# Altium schematic sheet 4_接口.schdoc.schdoc
size 309 x 223 mm; Symbol: Sheet-Symbol_A4; Device: Sheet-Symbol_A4; Company: 嘉立创EDA; Drawed: 吴登珂; Version: V1.0; Page Size: A4; @Project Name: 最小系统板; @Page Count: 4; @Update Date: 2024-04-09; @Create Date: 2024-04-05; @Schematic Name: Schematic1; @Page No: 2; @Page Name: 接口
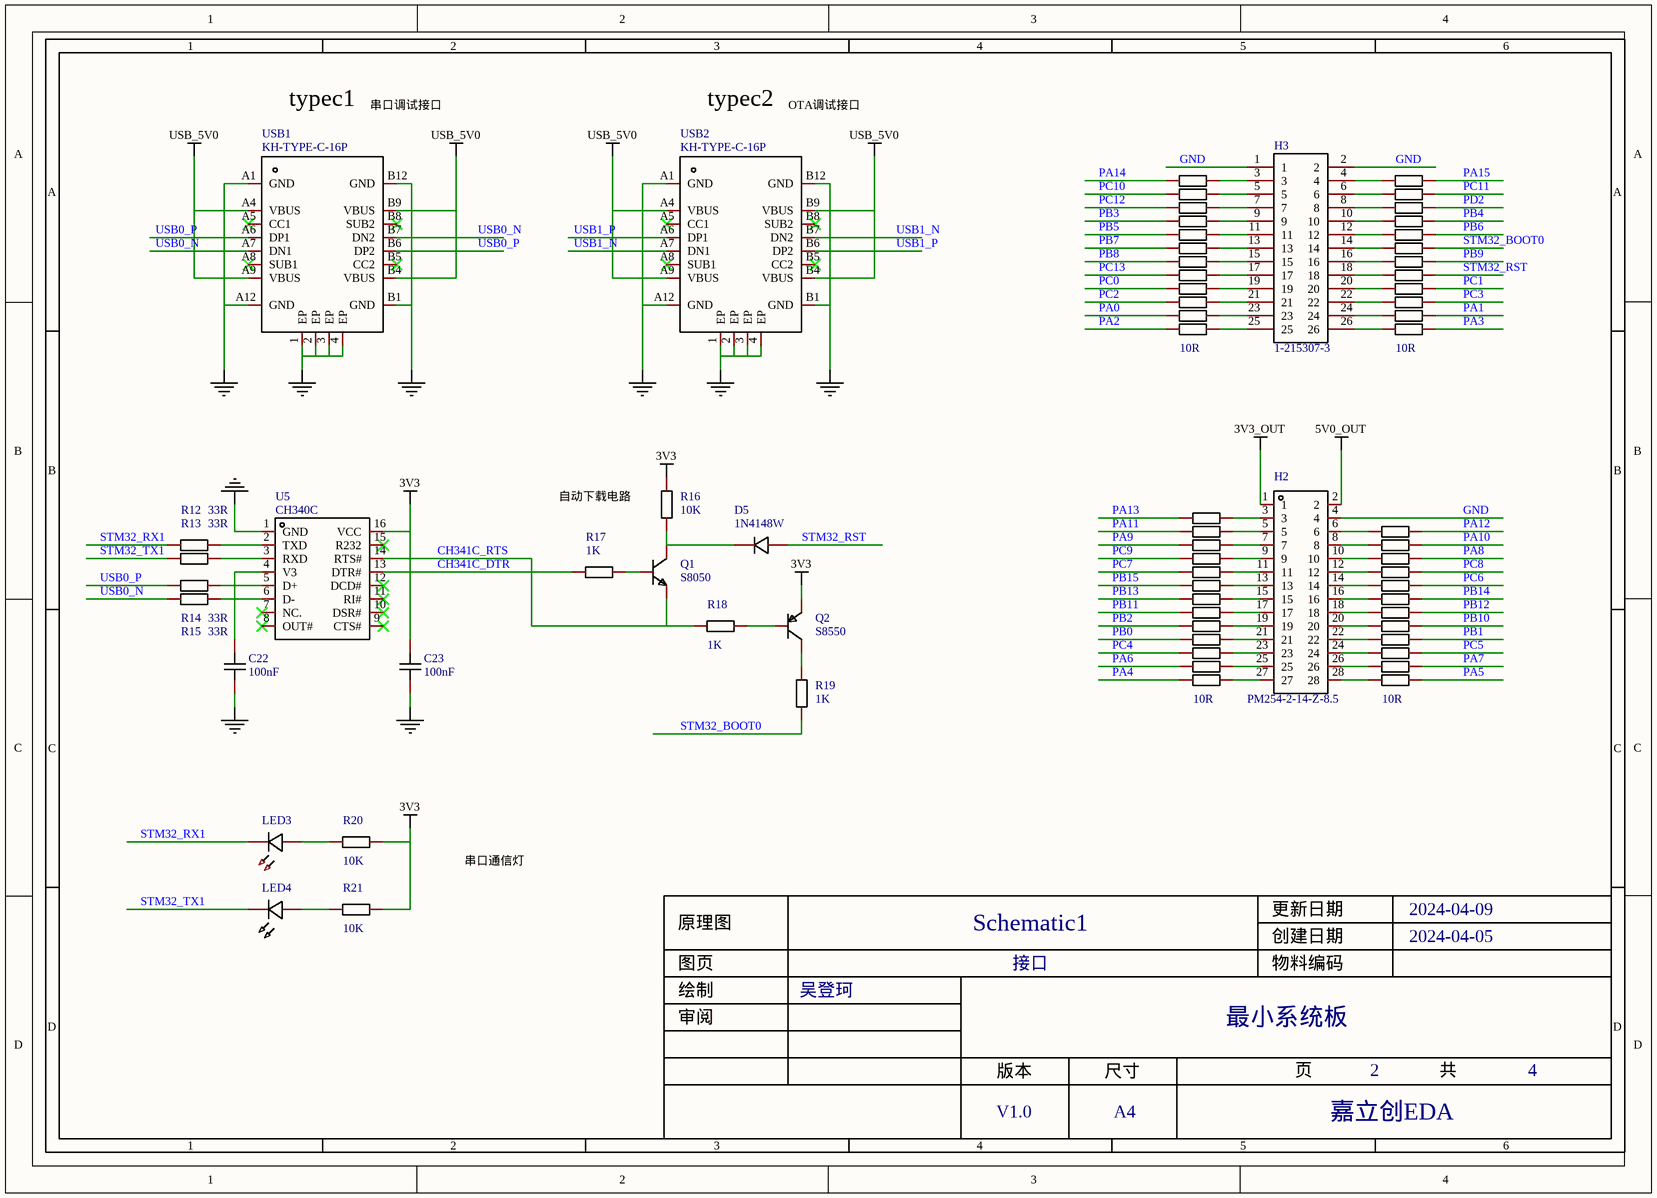
[diagram p0: 4_接口.schdoc.schdoc]

## Parts
C22  100nF  [C0603]
C23  100nF  [C0603]
D5  1N4148W  [SOD-123F_L2.7-W1.6-LS3.8-RD]
H2  PM254-2-14-Z-8.5  [HDR-TH_28P-P2.54-V-F-R2-C14-S2.54-1]
H3  1-215307-3  [HDR-TH_26P-P2.54-V-F-R2-C13-S2.54-1]
LED3  LED_0603-G  [LED_0603]  (value not drawn)
LED4  LED_0603-B  [LED_0603]  (value not drawn)
Q1  S8050  [SOT-23-3_L2.9-W1.3-P1.90-LS2.4-BR]
Q2  S8550  [SOT-23-3_L2.9-W1.6-P1.90-LS2.8-BR]
R12  33R  [R0603]
R13  33R  [R0603]
R14  33R  [R0603]
R15  33R  [R0603]
R16  10K  [R0603]
R17  1K  [R0603]
R18  1K  [R0603]
R19  1K  [R0603]
R20  10K  [R0603]
R21  10K  [R0603]
R27  10R  [R0603]  (value not drawn)
R28  10R  [R0603]  (value not drawn)
R29  10R  [R0603]  (value not drawn)
R30  10R  [R0603]  (value not drawn)
R31  10R  [R0603]  (value not drawn)
R32  10R  [R0603]  (value not drawn)
R33  10R  [R0603]  (value not drawn)
R34  10R  [R0603]  (value not drawn)
R35  10R  [R0603]  (value not drawn)
R36  10R  [R0603]  (value not drawn)
R37  10R  [R0603]  (value not drawn)
R38  10R  [R0603]
R39  10R  [R0603]  (value not drawn)
R40  10R  [R0603]  (value not drawn)
R41  10R  [R0603]  (value not drawn)
R42  10R  [R0603]  (value not drawn)
R43  10R  [R0603]  (value not drawn)
R44  10R  [R0603]  (value not drawn)
R45  10R  [R0603]  (value not drawn)
R46  10R  [R0603]  (value not drawn)
R47  10R  [R0603]  (value not drawn)
R48  10R  [R0603]  (value not drawn)
R49  10R  [R0603]  (value not drawn)
R50  10R  [R0603]
R51  10R  [R0603]  (value not drawn)
R52  10R  [R0603]  (value not drawn)
R53  10R  [R0603]  (value not drawn)
R54  10R  [R0603]  (value not drawn)
R55  10R  [R0603]  (value not drawn)
R56  10R  [R0603]  (value not drawn)
R57  10R  [R0603]  (value not drawn)
R58  10R  [R0603]  (value not drawn)
R59  10R  [R0603]  (value not drawn)
R60  10R  [R0603]  (value not drawn)
R61  10R  [R0603]  (value not drawn)
R62  10R  [R0603]  (value not drawn)
R63  10R  [R0603]
R64  10R  [R0603]
R65  10R  [R0603]  (value not drawn)
R66  10R  [R0603]  (value not drawn)
R67  10R  [R0603]  (value not drawn)
R68  10R  [R0603]  (value not drawn)
R69  10R  [R0603]  (value not drawn)
R70  10R  [R0603]  (value not drawn)
R71  10R  [R0603]  (value not drawn)
R72  10R  [R0603]  (value not drawn)
R73  10R  [R0603]  (value not drawn)
R74  10R  [R0603]  (value not drawn)
R75  10R  [R0603]  (value not drawn)
U5  CH340C  [SOP-16_L10.0-W3.9-P1.27-LS6.0-BL]
USB1  KH-TYPE-C-16P  [USB-C-SMD_KH-TYPE-C-16P]
USB2  KH-TYPE-C-16P  [USB-C-SMD_KH-TYPE-C-16P]

## Nets
3V3: C23.2 Q2.2 R16.2 R20.1 R21.1 U5.16(VCC)
3V3_OUT: H2.1
5V0_OUT: H2.2
NetC22_1: C22.1 C23.1 U5.1(GND) USB1.1(EP) USB1.2(EP) USB1.3(EP) USB1.4(EP) USB1.A1(GND) USB1.A12(GND) USB1.B1(GND) USB1.B12(GND) USB2.1(EP) USB2.2(EP) USB2.3(EP) USB2.4(EP) USB2.A1(GND) USB2.A12(GND) USB2.B1(GND) USB2.B12(GND)
USB_5V0: USB1.A4(VBUS) USB1.A9(VBUS) USB1.B4(VBUS) USB1.B9(VBUS) USB2.A4(VBUS) USB2.A9(VBUS) USB2.B4(VBUS) USB2.B9(VBUS)
CH341C_DTR: R17.1 U5.13(DTR#)
CH341C_RTS: Q1.2(E) R18.2 U5.14(RTS#)
GND: H2.4 H3.1 H3.2
PA0: R37.1
PA1: R49.2
PA2: R38.1
PA3: R50.2
PA4: R63.1
PA5: R64.2
PA6: R62.1
PA7: R65.2
PA8: R73.2
PA9: R53.1
PA10: R75.2
PA11: R52.1
PA12: R74.2
PA13: R51.1
PA14: R27.1
PA15: R39.2
PB0: R60.1
PB1: R67.2
PB2: R59.1
PB3: R30.1
PB4: R41.2
PB5: R31.1
PB6: R43.2
PB7: R32.1
PB8: R33.1
PB9: R45.2
PB10: R68.2
PB11: R58.1
PB12: R69.2
PB13: R57.1
PB14: R70.2
PB15: R56.1
PC0: R35.1
PC1: R47.2
PC2: R36.1
PC3: R48.2
PC4: R61.1
PC5: R66.2
PC6: R71.2
PC7: R55.1
PC8: R72.2
PC9: R54.1
PC10: R28.1
PC11: R40.2
PC12: R29.1
PC13: R34.1
PD2: R42.2
STM32_BOOT0: R19.1 R44.2
STM32_RST: D5.2(A) R46.2
STM32_RX1: LED3.1(C) R12.1
STM32_TX1: LED4.1(C) R13.1
USB0_N: R15.1 USB1.A7(DN1) USB1.B7(DN2)
USB0_P: R14.1 USB1.A6(DP1) USB1.B6(DP2)
USB1_N: USB2.A7(DN1) USB2.B7(DN2)
USB1_P: USB2.A6(DP1) USB2.B6(DP2)
NetC22_2: C22.2 U5.4(V3)
NetD5_1: D5.1(K) Q1.3(C) R16.1
NetH2_3: H2.3 R51.2
NetH2_5: H2.5 R52.2
NetH2_6: H2.6 R74.1
NetH2_7: H2.7 R53.2
NetH2_8: H2.8 R75.1
NetH2_9: H2.9 R54.2
NetH2_10: H2.10 R73.1
NetH2_11: H2.11 R55.2
NetH2_12: H2.12 R72.1
NetH2_13: H2.13 R56.2
NetH2_14: H2.14 R71.1
NetH2_15: H2.15 R57.2
NetH2_16: H2.16 R70.1
NetH2_17: H2.17 R58.2
NetH2_18: H2.18 R69.1
NetH2_19: H2.19 R59.2
NetH2_20: H2.20 R68.1
NetH2_21: H2.21 R60.2
NetH2_22: H2.22 R67.1
NetH2_23: H2.23 R61.2
NetH2_24: H2.24 R66.1
NetH2_25: H2.25 R62.2
NetH2_26: H2.26 R65.1
NetH2_27: H2.27 R63.2
NetH2_28: H2.28 R64.1
NetH3_3: H3.3 R27.2
NetH3_4: H3.4 R39.1
NetH3_5: H3.5 R28.2
NetH3_6: H3.6 R40.1
NetH3_7: H3.7 R29.2
NetH3_8: H3.8 R42.1
NetH3_9: H3.9 R30.2
NetH3_10: H3.10 R41.1
NetH3_11: H3.11 R31.2
NetH3_12: H3.12 R43.1
NetH3_13: H3.13 R32.2
NetH3_14: H3.14 R44.1
NetH3_15: H3.15 R33.2
NetH3_16: H3.16 R45.1
NetH3_17: H3.17 R34.2
NetH3_18: H3.18 R46.1
NetH3_19: H3.19 R35.2
NetH3_20: H3.20 R47.1
NetH3_21: H3.21 R36.2
NetH3_22: H3.22 R48.1
NetH3_23: H3.23 R37.2
NetH3_24: H3.24 R49.1
NetH3_25: H3.25 R38.2
NetH3_26: H3.26 R50.1
NetLED3_2: LED3.2(A) R20.2
NetLED4_2: LED4.2(A) R21.2
NetQ1_1: Q1.1(B) R17.2
NetQ2_1: Q2.1 R18.1
NetQ2_3: Q2.3 R19.2
NetR12_2: R12.2 U5.2(TXD)
NetR13_2: R13.2 U5.3(RXD)
NetR14_2: R14.2 U5.5(D+)
NetR15_2: R15.2 U5.6(D-)

Not connected (* = marked no-connect by the designer): U5 7(NC.)* 8(OUT#)* 9(CTS#)* 10(DSR#)* 11(RI#)* 12(DCD#)* 15(R232)*; USB1 A5(CC1)* A8(SUB1)* B5(CC2)* B8(SUB2)*; USB2 A5(CC1)* A8(SUB1)* B5(CC2)* B8(SUB2)*

## Notes on the sheet
- typec1
- 串口调试接口
- typec2
- OTA调试接口
- 自动下载电路
- 串口通信灯
- 1
- 2
- 3
- 4
- 5
- 6
- A
- B
- C
- 原理图
- Schematic1
- 创建日期
- 更新日期
- 2024-04-09
- 2024-04-05
- 审阅
- 绘制
- 图页
- 吴登珂
- 接口
- 物料编码
- 最小系统板
- D
- 版本
- 尺寸
- 页
- 共
- V1.0
- A4
- 嘉立创EDA

## Library data of the parts
C22 C23 = CAP_0603: Symbol: CapAcitance; Convert to PCB: yes; Name: 100nF; Device: CAP_0603; Add into BOM: yes; Supplier Footprint: 0603; Value: 100nF
D5 = 1N4148W_C81598: Manufacturer: ST(先科); Add into BOM: yes; Diode Configuration: 独立式; Forward Voltage (Vf@If): 1V@50mA; Reverse Voltage (Vr): 75V; Average Rectified Current (Io): 150mA; Power Dissipation: 400mW; Reverse Leakage Current: 1uA@75V; Reverse Recovery Time (trr): 4ns; Description: 二极管配置:独立式;正向压降(Vf):1V@50mA;直流反向耐压(Vr):75V;平均整流电流(Io):150mA;功率:400mW;反向恢复时间(trr):4ns;; Name: 1N4148W; Symbol: 1N4148W_C81598; Device: 1N4148W_C81598; Supplier: LCSC; Manufacturer Part: 1N4148W; Supplier Part: C81598; JLCPCB Part Class: 基础库; LCSC Part Name: 电压:75V 电流:150mA; Supplier Footprint: SOD-123; Datasheet: https://atta.szlcsc.com/upload/public/pdf/source/20161024/1477288446905.pdf; Convert to PCB: yes; Operating Temperature: -
H2 = PM254-2-14-Z-8.5: Manufacturer: HCTL(华灿天禄); Add into BOM: yes; Holes Structure: 2x14P; Pitch: 2.54mm; Circular Hole / Square Hole: 方孔; Number of Holes: 28P; Current Rating (Max): 3A; Holes Direction: 顶部; Soldering Temperature(Max): 260℃@5S; Description: 插孔结构:2x14P;间距:2.54mm;行距:2.54mm;圆孔/方孔:方孔;安装类型:直插;排数:双排;总孔位数:28P;额定电流:3A;额定电压:-;插孔方向:顶部;塑高:8.5mm;触头材质:铜合金;工作温度范围:-40℃~+105℃;焊接温度(最大值):260℃@5S;; Name: PM254-2-14-Z-8.5; Symbol: PM254-2-14-Z-8.5; Device: PM254-2-14-Z-8.5; LCSC Part Name: 2x14P 间距:2.54mm 直插; Supplier Part: C2897415; Manufacturer Part: PM254-2-14-Z-8.5; Supplier Footprint: 插件,P=2.54mm; JLCPCB Part Class: 扩展库; Datasheet: https://atta.szlcsc.com/upload/public/pdf/source/20230609/3D36CA2C1BFC9FD1C3F709AD9DFEB9C2.pdf; Supplier: LCSC; Convert to PCB: yes; Row Spacing: 2.54mm; Mounting Type: 直插; Number of Rows: 双排; Voltage Rating (Max): -; Insulation Height: 8.5mm; Contact Material: 铜合金; Operating Temperature Range: -40℃~+105℃
H3 = 1-215307-3: Manufacturer: TE Connectivity(泰科电子); Add into BOM: yes; Holes Structure: 2x13P; Pitch: 2.54mm; Number of Holes: 26P; Description: 插孔结构:2x13P;间距:2.54mm;行距:2.54mm;安装类型:直插;排数:双排;总孔位数:26P;塑高:7mm;触头材质:磷青铜;触头镀层:锡;; Name: 1-215307-3; Symbol: 1-215307-3; Device: 1-215307-3; LCSC Part Name: 间距:2.54mm 2x13P 直插; Supplier Part: C306162; Manufacturer Part: 1-215307-3; Supplier Footprint: 插件,P=2.54mm; JLCPCB Part Class: 扩展库; Datasheet: https://atta.szlcsc.com/upload/public/pdf/source/20181106/C306162_A5692CDC64CD04F4B4B72A14E7600F8F.pdf; Supplier: LCSC; Convert to PCB: yes; Row Spacing: 2.54mm; Mounting Type: 直插; Number of Rows: 双排; Insulation Height: 7mm; Contact Material: 磷青铜; Contact Plating: 锡
LED3 = LED_0603-G: Symbol: LED_G; Convert to PCB: yes; Device: LED_0603-G; Add into BOM: yes; Supplier Footprint: 0603
LED4 = LED_0603-B: Symbol: LED_B; Convert to PCB: yes; Device: LED_0603-B; Add into BOM: yes; Supplier Footprint: 0603
Q1 = S8050: Manufacturer: Doeshare(德芯); Symbol: S8050_C2931719; Add into BOM: yes; Description: NPN 25V 500mA 120-400 SOT-23; Name: S8050; Device: S8050; LCSC Part Name: S8050; Supplier Part: C2931719; Manufacturer Part: S8050; Supplier Footprint: SOT-23; JLCPCB Part Class: 扩展库; Datasheet: https://atta.szlcsc.com/upload/public/pdf/source/20220117/E6D3315E0D6ADDB25840BFFAC039C5C0.pdf; Supplier: LCSC; Convert to PCB: yes
Q2 = S8550_C105432: Manufacturer: CJ(江苏长电/长晶); Add into BOM: yes; Transistor Type: PNP; Collector Current (Ic): 500mA; Collector-Emitter Breakdown Voltage (Vceo): 25V; Power Dissipation (Pd): 300mW; DC Current Gain (hFE@Ic,Vce): 120@50mA,1V; Transition Frequency (fT): 150MHz; Collector Cut-Off Current (Icbo): 100nA; Collector-Emitter Saturation Voltage (VCE(sat)@Ic,Ib): 600mV@500mA,50mA; Description: 晶体管类型:PNP;集电极电流(Ic):500mA;集射极击穿电压(Vceo):25V;功率(Pd):300mW;直流电流增益(hFE@Ic,Vce):120@50mA,1V;; Name: S8550; Symbol: S8550_C105432; Device: S8550_C105432; LCSC Part Name: S8550(RANGE:120-200) L档120-200; Supplier Part: C105432; Manufacturer Part: S8550; Supplier Footprint: SOT-23; JLCPCB Part Class: 基础库; Datasheet: https://atta.szlcsc.com/upload/public/pdf/source/20171228/C164891_15144412930301213894.pdf; Supplier: LCSC; Convert to PCB: yes; Operating Temperature: -
R12-R21 R27-R75 = Res_0603: Symbol: 电阻; Convert to PCB: yes; Device: Res_0603; Add into BOM: yes; Supplier Footprint: 0603
  R12-R15: Name: 33R; Value: 33R
  R16 R20 R21: Name: 10K; Value: 10K
  R17-R19: Name: 1K; Value: 1K
  R27-R75: Name: 10R; Value: 10R
U5 = CH340C: Manufacturer: WCH(南京沁恒); Add into BOM: yes; Applications Function: 收发器; Protocol: USB 2.0; Supply Voltage: 3.3V；5V; Data Rate: 2Mbps; Description: 应用功能:收发器;接口协议:USB 2.0;数据速率:2Mbps;; Name: CH340C; Symbol: CH340C; Device: CH340C; Supplier: LCSC; Manufacturer Part: CH340C; Supplier Part: C84681; JLCPCB Part Class: 扩展库; LCSC Part Name: CH340C USB转串口芯片 CH340; Supplier Footprint: SOP-16; Datasheet: https://atta.szlcsc.com/upload/public/pdf/source/20200819/C84681_ADBED554CE321879DBD6B1D06488689C.pdf; Convert to PCB: yes
USB1 USB2 = KH-TYPE-C-16P: Manufacturer: kinghelm(金航标); Add into BOM: yes; Connector Type: Type-C; Gender: 母; Number of Ports: 1; Number of Contacts: 16P; Current Rating - Power (Max): 3A; Description: 连接器类型:Type-C;标准:-;公母:母;端口数量:1;触点数量:16P;安装方式:卧贴;额定电流 - 电源:3A;工作温度范围:-40℃~+85℃;; Name: KH-TYPE-C-16P; Symbol: KH-TYPE-C-16P; Device: KH-TYPE-C-16P; LCSC Part Name: Type-C 母 卧贴; Supplier Part: C709357; Manufacturer Part: KH-TYPE-C-16P; Supplier Footprint: SMD; JLCPCB Part Class: 扩展库; Datasheet: https://atta.szlcsc.com/upload/public/pdf/source/20200911/C709357_AA8DCEB38BB20E3035A7ED7AE7667837.pdf; Supplier: LCSC; Convert to PCB: yes; Standard: -; Mounting Style: 卧贴; Operating Temperature Range: -40℃~+85℃